# EAGLE design d11toy4 (EAGLE 6.6.0)
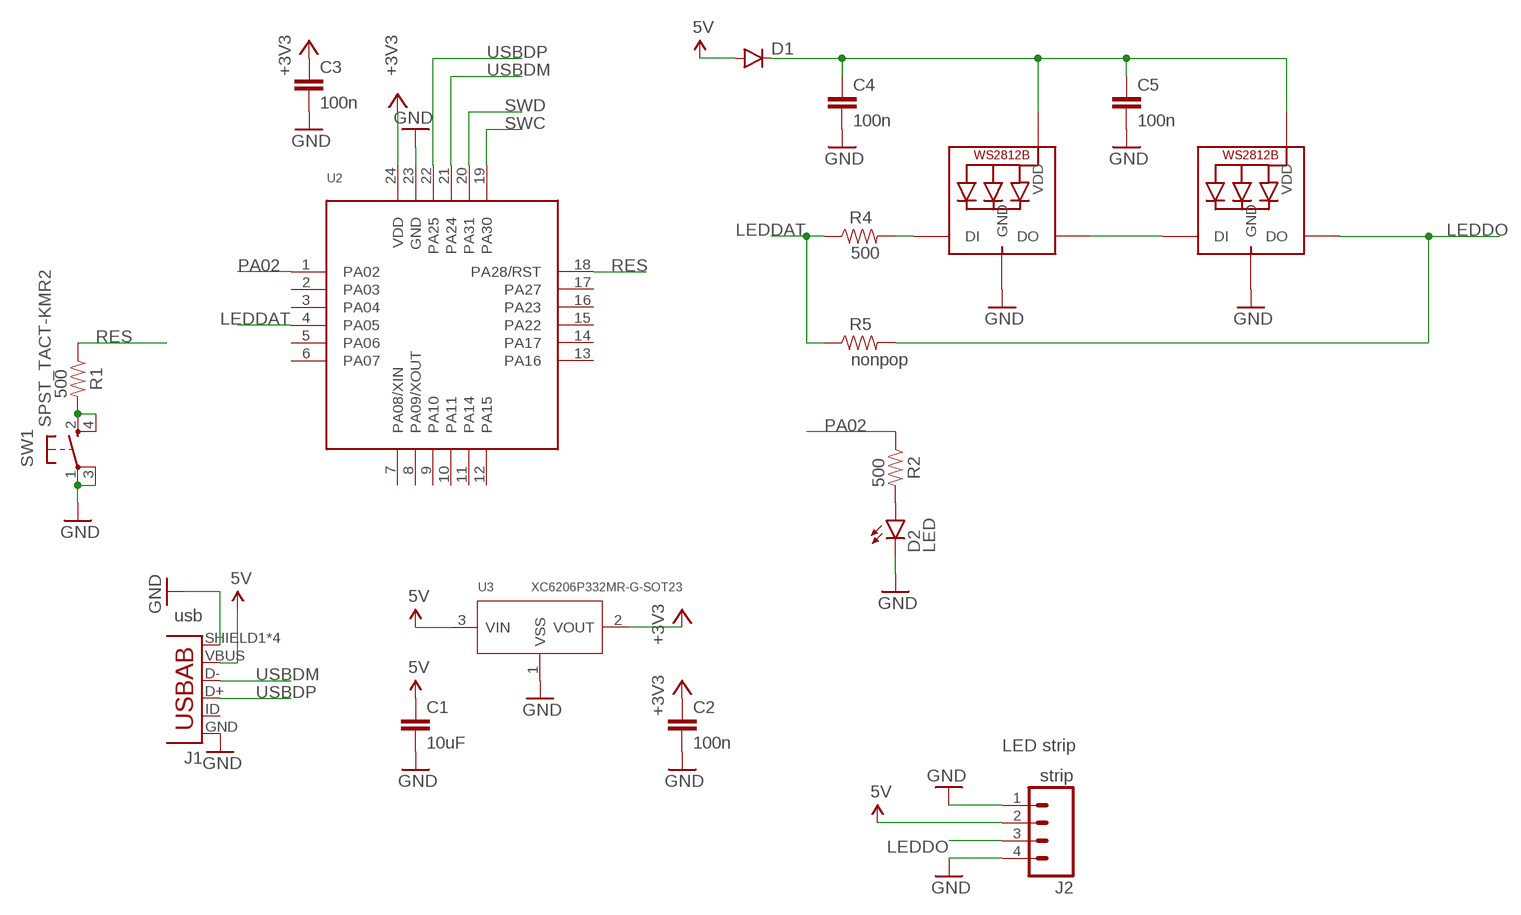
[diagram p0: schematic, sheet 1]

## Parts
C1  10uF  CAP0603-CAP  [0603-CAP]
C2  100n  CAP0603-CAP  [0603-CAP]
C3  100n  CAP0603-CAP  [0603-CAP]
C4  100n  CAP0603-CAP  [0603-CAP]
C5  100n  CAP0603-CAP  [0603-CAP]
D1  DIODESOD523  [SOD523]
D2  LED  LED0603  [LED-0603]
J1  usb  USB-AB  [USB-AB-MICRO-SMD]
J2  strip  M04NO_SILK_ALL_ROUND  [1X04_NO_SILK_ALL_ROUND]
LED1  WS2812B5050  [WS2812B]
LED2  WS2812B5050  [WS2812B]
R1  500  RESISTOR0603-RES  [0603-RES]
R2  500  RESISTOR0603-RES  [0603-RES]
R4  500  RESISTOR0603-RES  [0603-RES]
R5  nonpop  RESISTOR0603-RES  [0603-RES]
SW1  SPST_TACT-KMR2  [KMR2]
U2  SAMD11D14AM  [QFN24]
U3  XC6206P332MR-G-SOT23  PMIC-LDO-XC6206P332MR-G(SOT23)  [SOT-23]

## Nets
5V: C1.1 D1.A J1.VBUS J2.2 U3.3(VIN)
+3V3: C2.1 C3.1 U2.24(VDD) U3.2(VOUT)
GND: C1.2 C2.2 C3.2 C4.2 C5.2 D2.C J1.GND J1.SHIELD1(SHIELD) J1.SHIELD2(SHIELD) J1.SHIELD3(SHIELD) J1.SHIELD4(SHIELD) J2.1 J2.4 LED1.3-GND(GND) LED2.3-GND(GND) SW1.1(P) SW1.3(P1) U2.23(GND) U3.1(VSS)
LEDDAT: R4.1 R5.1 U2.4(PA05)
LEDDO: J2.3 LED2.2-DOUT(DO) R5.2
N$1: D2.A R2.2
N$2: R1.2 SW1.2(S) SW1.4(S1)
N$3: LED1.2-DOUT(DO) LED2.4-DIN(DI)
N$4: C4.1 C5.1 D1.C LED1.1-VDD(VDD) LED2.1-VDD(VDD)
N$5: LED1.4-DIN(DI) R4.2
PA02: R2.1 U2.1(PA02)
RES: R1.1 U2.18(PA28/RST)
SWC: U2.19(PA30)
SWD: U2.20(PA31)
USBDM: J1.D- U2.21(PA24)
USBDP: J1.D+ U2.22(PA25)
Unconnected: J1.ID(USBID) U2.2(PA03) U2.3(PA04) U2.5(PA06) U2.6(PA07) U2.7(PA08/XIN) U2.8(PA09/XOUT) U2.9(PA10) U2.10(PA11) U2.11(PA14) U2.12(PA15) U2.13(PA16) U2.14(PA17) U2.15(PA22) U2.16(PA23) U2.17(PA27)

## Notes on the sheet
- LED strip

## Library data of the parts
C1-C5 = SparkFun-Capacitors:CAP: Capacitor Standard 0603 ceramic capacitor, and 0.1" leaded capacitor.
D1 = SparkFun-DiscreteSemi:DIODE: Diode These are standard reverse protection diodes and small signal diodes. SMA package can handle up to about 1A. SOD-323 can handle about 200mA. What the SOD-323 package when ordering, there are some mfgs out there that are 5-pin packages.
D2 = SparkFun-LED:LED: LEDs Standard schematic elements and footprints for 5mm, 3mm, 1206, and 0603 sized LEDs. 5mm - Spark Fun Electronics SKU : COM-00529 (and others)
J1 = SparkFun-Connectors:USB-AB: This is a USB AB connector that is compatible with USB OTG. i.e. this connector can serve as a host or device
J2 = SparkFun-Connectors:M04: Header 4 Standard 4-pin 0.1" header. Use with straight break away headers (SKU : PRT-00116), right angle break away headers (PRT-00553), swiss pins (PRT-00743), machine pins (PRT-00117), and female headers (PRT-00115). Molex polarized connector foot print use with SKU : PRT-08231 with associated crimp pins and housings. 1MM SMD Version SKU: PRT-10208; PROD_ID: CONN-09696
LED1 LED2 = adafruit:WS2812B
R1 R2 R4 R5 = SparkFun-Passives:RESISTOR: Resistor Basic schematic elements and footprints for 0603, 1206, and PTH resistors.
SW1 = adafruit:SPST_TACT: SMT 6mm switch, EVQQ2 series http://www.ladyada.net/library/eagle
U2 = todstuff:SAMD11D14AM: Atmel SAMD11 ATSAMD11D14A - 24-pin QFN
U3 = Seeed-IC-2016:PMIC-LDO-XC6206P332MR-G(SOT23): 310030099; MPN: XC6206P332MR-G

## Board
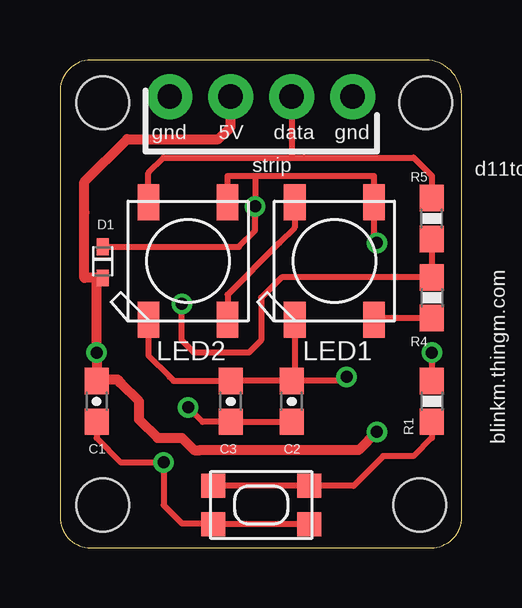
[diagram p1: board, top side]
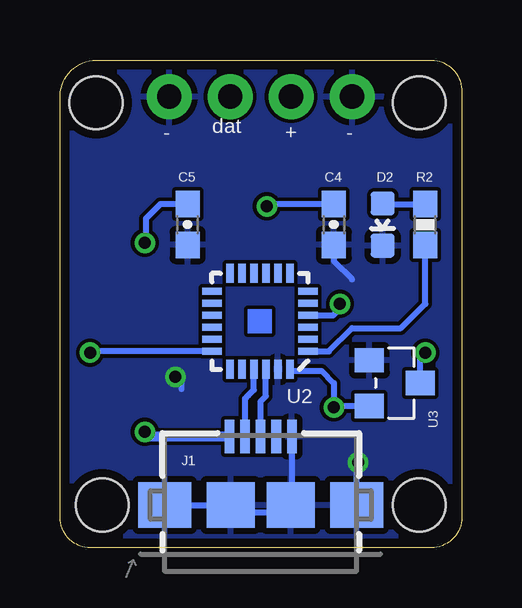
[diagram p2: board, bottom side, seen from below]

Size 16.74 x 20.32 mm. Coordinates in mm from the lower left corner, seen from the top.
Outline: 0,18.97 0,1.27 arc90 1.27,0 15.47,0 arc90 16.74,1.27 16.74,18.72 arc90 15.24,20.32 1.27,20.32 arc90 0,18.97
Copper layers (1*16): Top 0.0356mm / dielectric 1.5011mm / Bottom 0.0356mm
Design rules "LaenPCBOrderTodTent": minimum track width 6mil, minimum drill 13mil, track to track 6mil, track to pad 6mil, pad to pad 6mil, via to via 6mil, smd to smd 6mil, copper to edge 15mil, drill to drill 6mil, minimum pad ring 7mil, minimum via ring 7mil, stop-mask expansion 3mil, vias tented up to drill 20mil, thermal gap 10mil
Holes 2.2 mm at 14.99,1.78 15.24,18.54 1.78,1.78 1.78,18.54

### Footprints (pad centres in the part's own frame; a part is rotated, then mirrored left to right if it is on the bottom)
0603-CAP = smd 1.1 x 1: 1 -0.85,0; 2 0.85,0
SOD523 = smd 0.7 x 0.5: A 0.7,0; C -0.6,0
LED-0603 = smd 1 x 1: A 0,-0.877; C 0,0.877
USB-AB-MICRO-SMD = smd 1.4 x 0.4: D+ 2.85,0; D- 2.85,0.65; GND 2.85,-1.3; ID 2.85,-0.65; VBUS 2.85,1.3 | smd 1.9 x 2.2: SHIELD1 0,4; SHIELD4 0,-4 | smd 1.9 x 2: SHIELD2 0,1.25; SHIELD3 0,-1.25
1X04_NO_SILK_ALL_ROUND = drill 1.016 pad 1.88: 1 0,0; 2 2.54,0; 3 5.08,0; 4 7.62,0
WS2812B = smd 1.5 x 0.9: 1-VDD 2.45,-1.65; 2-DOUT 2.45,1.65; 3-GND -2.45,1.65; 4-DIN -2.45,-1.65
0603-RES = smd 1.1 x 1: 1 -0.85,0; 2 0.85,0
KMR2 = smd 1 x 1: 1 2,0.8; 2 2,-0.8; 3 -2,0.8; 4 -2,-0.8
QFN24 = smd 0.8 x 0.3: 1 -1.46,0.71; 2 -1.46,0.21; 3 -1.46,-0.29; 4 -1.46,-0.79; 5 -1.46,-1.29; 6 -1.46,-1.79; 13 2.54,-1.79; 14 2.54,-1.29; 15 2.54,-0.79; 16 2.54,-0.29; 17 2.54,0.21; 18 2.54,0.71 | smd 0.3 x 0.8: 7 -0.71,-2.54; 8 -0.21,-2.54; 9 0.29,-2.54; 10 0.79,-2.54; 11 1.29,-2.54; 12 1.79,-2.54; 19 1.79,1.46; 20 1.29,1.46; 21 0.79,1.46; 22 0.29,1.46; 23 -0.21,1.46; 24 -0.71,1.46
SOT-23 = smd 1.016 x 1.2: 1 -0.95,-1.06; 2 0.95,-1.06; 3 0,1.06

### Placement (x,y rotation side)
C1  1.52,6.1 270 top
C2  9.65,6.1 90 top
C3  7.11,6.1 90 top
C4  5.33,13.46 270 bottom
C5  11.43,13.46 270 bottom
D1  1.78,11.94 270 top
D2  3.3,13.46 180 bottom
J1  8.38,1.78 90 bottom
J2  4.57,18.8 0 top
LED1  11.43,11.94 90 top
LED2  5.33,11.94 90 top
R1  15.49,6.1 270 top
R2  1.52,13.46 90 bottom
R4  15.49,10.41 270 top
R5  15.49,13.72 90 top
SW1  8.38,1.78 180 top
U2  7.87,8.89 180 bottom
U3  2.79,6.86 270 bottom

### Tracks (layer width: path | path; a pad name or v marks a point on that pad's centre or on a via)
5V  (via drill 0.5)
  Top 0.254: 1.59,7.01 C1.1 | 1.52,11.24 D1.A
  Top 0.406: v13.21,4.83 12.45,4.06 5.84,4.06 5.59,4.06 5.08,4.57 4.06,4.57 3.3,5.33 3.3,6.1 2.54,6.86 2.39,7.01 1.59,7.01 | C1.1 v1.52,8.13 1.52,11.24 | D1.A 1.02,11.24 1.02,13.97 1.02,15.24 2.79,17.02 6.6,17.02 7.11,17.53 J2.2
  Bottom 0.254: 13.01,4.63 v13.21,4.83 | U3.3 1.73,7.92 v1.52,8.13
  Bottom 0.406: J1.VBUS 13.01,4.63
  pour Top: -5.33,22.86 -6.35,22.86 -6.35,0 -5.33,0
+3V3  (via drill 0.5)
  Top 0.254: C2.1 C3.1 5.93,5.25 v5.33,5.84
  Bottom 0.254: U2.24 7.1,7.37 5.84,7.37 5.33,6.86 v5.33,5.84 5.27,5.91 5.4,5.91 | 5.4,5.91 U3.2 5.4,5.91
GND  (via drill 0.5)
  Top 0.254: SW1.3 SW1.1 6.34,1.02 5.08,1.02 4.32,1.78 v4.32,3.56 2.54,3.56 1.52,4.57 C1.2 | LED1.3-GND 9.78,7.07 C2.2 | LED2.3-GND 3.68,8 4.57,7.11 4.74,6.95 C3.2 C2.2 | v11.94,7.11 11.77,6.95 C2.2
  Bottom 0.254: C4.2 5.33,11.94 4.57,11.18 | J1.GND 7.08,1.78 J1.SHIELD3 | J1.SHIELD1 J1.SHIELD2 9.63,1.49 6.38,1.49 | J1.SHIELD4 4.38,3.3 v4.32,3.56 | v11.94,7.11 11.68,7.11 11.68,6.6
  pour Bottom: 17.78,21.59 0,21.59 0,0 17.78,0
LEDDAT  (via drill 0.5)
  Top 0.254: R5.1 R4.1 9.23,11.26 8.38,10.41 8.38,8.64 7.87,8.13 5.59,8.13 5.08,8.64 v5.08,10.16
  Bottom 0.254: 5.08,9.91 v5.08,10.16 5.08,9.96 5.36,9.68 U2.4
LEDDO
  Top 0.254: 15.49,14.48 R5.2 15.49,15.49 14.73,16.26 10.16,16.26 | LED2.2-DOUT 3.68,15.62 4.32,16.26 9.65,16.26 | 9.65,16.26 10.16,16.26 | J2.3 9.65,16.26 | 9.65,16.26 10.16,16.26
N$1
  Bottom 0.254: D2.A 3.27,14.31 R2.2
N$2
  Top 0.254: R1.2 15.49,4.57 14.73,3.81 13.46,3.81 12.23,2.58 SW1.4 SW1.2
N$3
  Top 0.254: LED1.2-DOUT 9.78,13.34 9.14,12.7 6.98,10.54 LED2.4-DIN
N$4  (via drill 0.5)
  Top 0.254: D1.C 4.92,12.54 7.46,12.54 8.13,13.21 v8.13,14.22 8.13,15.49 | LED2.1-VDD 6.98,15.49 8.13,15.49 | 13.08,14.48 LED1.1-VDD 13.08,14.48 | 8.13,15.49 12.7,15.49 13.08,15.49 13.08,14.48 | 13.08,14.48 13.08,12.83 v13.21,12.7
  Bottom 0.254: C4.1 6.35,14.31 7.87,14.31 v8.13,14.22 | C5.1 12.56,14.31 13.16,13.71 13.16,12.75 v13.21,12.7
N$5
  Top 0.254: R4.2 13.08,9.56 LED1.4-DIN
PA02
  Bottom 0.254: U2.1 5.54,8.18 4.57,9.14 2.54,9.14 1.52,10.16 R2.1
RES  (via drill 0.5)
  Top 0.254: v15.49,8.13 R1.1
  Bottom 0.254: U2.18 15.44,8.18 v15.49,8.13
USBDM
  Bottom 0.254: J1.D- 9.03,6.21 8.89,6.35 8.66,6.58 U2.21
USBDP
  Bottom 0.254: J1.D+ 8.38,6.1 8.16,6.31 U2.22

### Text on the board
tPlace: gnd | 5V | data | gnd | strip | d11toy4 | BlinkM Neo | blinkm.thingm.com
bPlace: - | + | dat | -